# Altium schematic sheet Connectors.SchDoc
size A3; DocumentNumber: 2; SheetNumber: 2; SheetTotal: 9
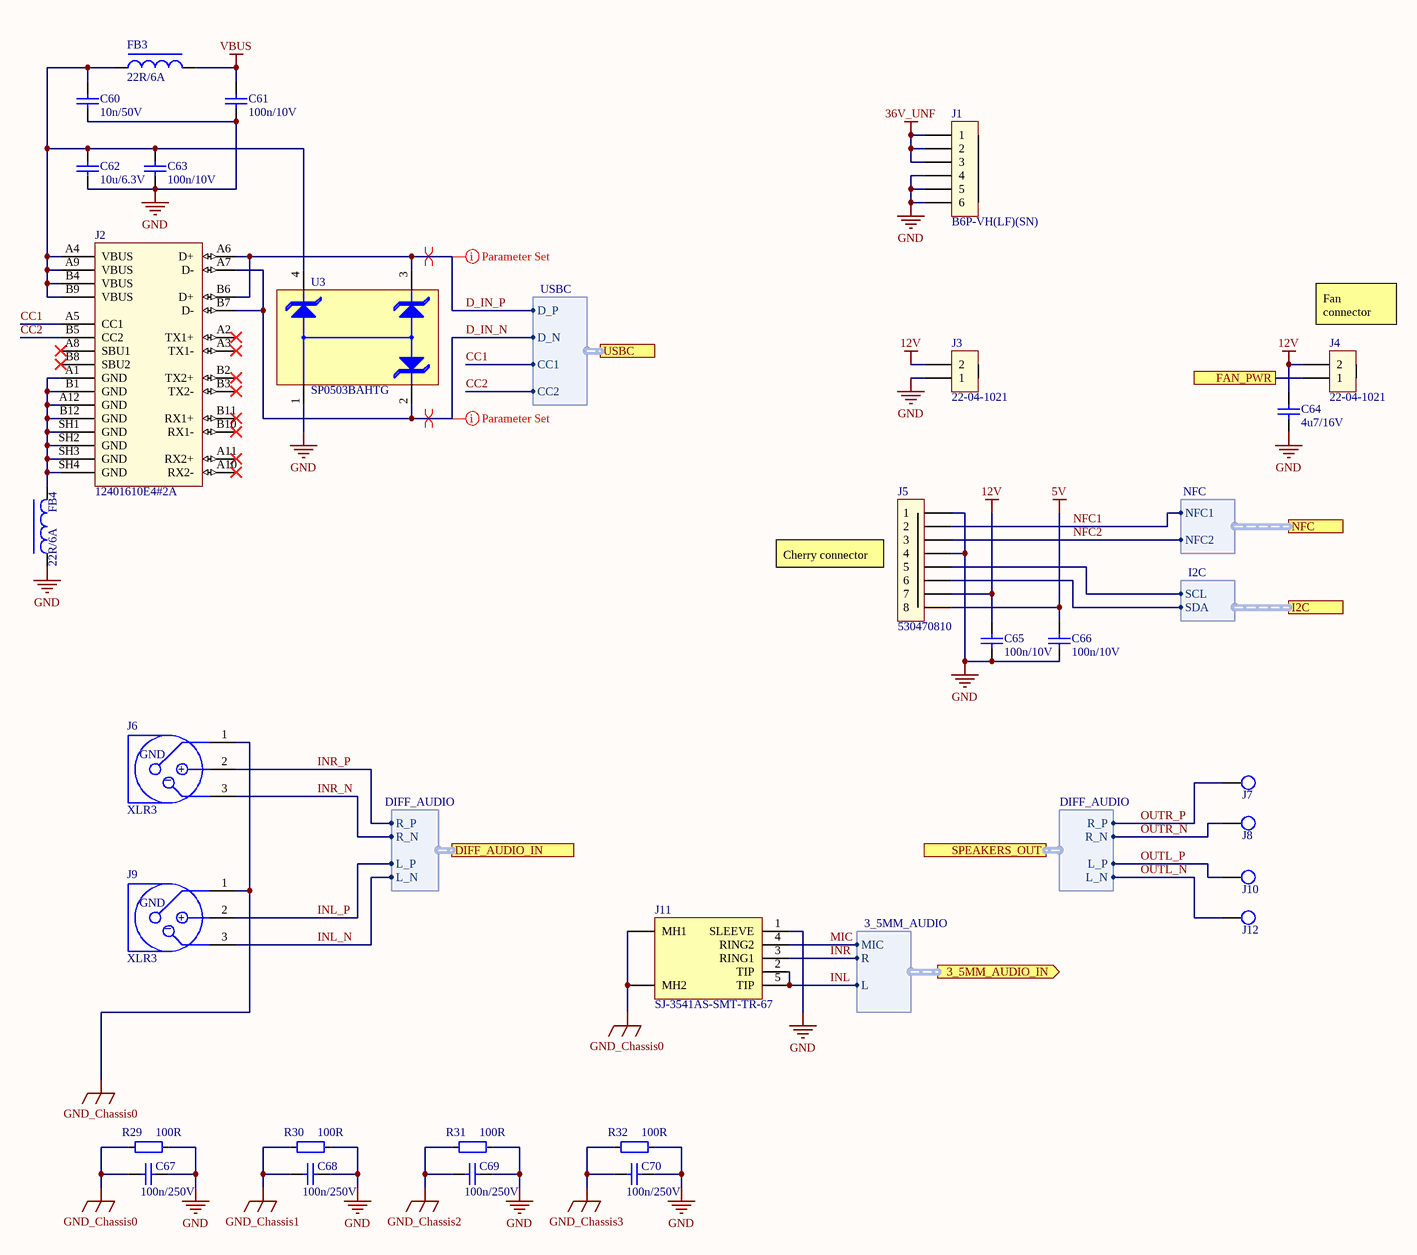
[diagram p0: Connectors.SchDoc]

## Parts
C60  10n/50V  [C0402]
C61  100n/10V  [C0402]
C62  10u/6.3V  [C0805]
C63  100n/10V  [C0402]
C64  4u7/16V  [C0805]
C65  100n/10V  [C0402]
C66  100n/10V  [C0402]
C67  100n/250V  [C1210]
C68  100n/250V  [C1210]
C69  100n/250V  [C1210]
C70  100n/250V  [C1210]
FB3  22R/6A  [FB0805]
FB4  22R/6A  [FB0805]
J1  B6P-VH(LF)(SN)  [B6P-VH]
J2  12401610E4#2A  [12401610E4#2A]
J3  22-04-1021  [22-04-1021]
J4  22-04-1021  [22-04-1021]
J5  530470810  [530470810]
J6  XLR3  [NC3FAAH1]
J7  AUDIO_JACK  [AUDIO_JACK_RED]  (value not drawn)
J8  AUDIO_JACK  [AUDIO_JACK_BLACK]  (value not drawn)
J9  XLR3  [NC3FAAH1]
J10  AUDIO_JACK  [AUDIO_JACK_RED]  (value not drawn)
J11  SJ-3541AS-SMT-TR-67  [SJ-3541AS-SMT-TR-67]
J12  AUDIO_JACK  [AUDIO_JACK_BLACK]  (value not drawn)
R29  100R  [R1206]
R30  100R  [R1206]
R31  100R  [R1206]
R32  100R  [R1206]
U3  SP0503BAHTG  [SOT143-4]

## Ports
3_5MM_AUDIO_IN (out, harness 3_5MM_AUDIO), DIFF_AUDIO_IN (harness DIFF_AUDIO), FAN_PWR, I2C (harness I2C), NFC (harness NFC), SPEAKERS_OUT (harness DIFF_AUDIO), USBC (harness USBC)

## Harnesses
USBC: D_P, D_N, CC1, CC2
DIFF_AUDIO: L_P, L_N, R_P, R_N
DIFF_AUDIO: L_N, L_P, R_N, R_P
3_5MM_AUDIO: R, L, MIC
NFC: NFC1, NFC2
I2C: SCL, SDA

## Nets
5V: C66.2 J5.8
12V: C64.2 C65.2 J3.2 J4.2 J5.7
36V_UNF: J1.1 J1.2 J1.3
GND: C60.1 C61.1 C62.1 C63.1 C64.1 C65.1 C66.1 C67.2 C68.2 C69.2 C70.2 FB4.1 J1.4 J1.5 J1.6 J3.1 J5.1 J5.4 J11.1(SLEEVE) R29.2 R30.2 R31.2 R32.2 U3.1
GND_Chassis0: C67.1 J6.1(GND) J9.1(GND) J11.MH1 J11.MH2 R29.1
GND_Chassis1: C68.1 R30.1
GND_Chassis2: C69.1 R31.1
GND_Chassis3: C70.1 R32.1
VBUS: C61.2 FB3.2
CC1: J2.A5(CC1) ; port USBC.CC1
CC2: J2.B5(CC2) ; port USBC.CC2
D_IN_N: J2.A7(D-) J2.B7(D-) U3.2 ; port USBC.D_N
D_IN_P: J2.A6(D+) J2.B6(D+) U3.3 ; port USBC.D_P
FAN_PWR: J4.1 ; port FAN_PWR
INL: J11.2(TIP) J11.5(TIP) ; port 3_5MM_AUDIO_IN.L
INL_N: J9.3(-) ; port DIFF_AUDIO_IN.L_N
INL_P: J9.2(+) ; port DIFF_AUDIO_IN.L_P
INR: J11.3(RING1) ; port 3_5MM_AUDIO_IN.R
INR_N: J6.3(-) ; port DIFF_AUDIO_IN.R_N
INR_P: J6.2(+) ; port DIFF_AUDIO_IN.R_P
MIC: J11.4(RING2) ; port 3_5MM_AUDIO_IN.MIC
NFC1: J5.2 ; port NFC.NFC1
NFC2: J5.3 ; port NFC.NFC2
OUTL_N: J12.1 ; port SPEAKERS_OUT.L_N
OUTL_P: J10.1 ; port SPEAKERS_OUT.L_P
OUTR_N: J8.1 ; port SPEAKERS_OUT.R_N
OUTR_P: J7.1 ; port SPEAKERS_OUT.R_P
NetC60_2: C60.2 C62.2 C63.2 FB3.1 J2.A4(VBUS) J2.A9(VBUS) J2.B4(VBUS) J2.B9(VBUS) U3.4
NetFB4_2: FB4.2 J2.A1(GND) J2.A12(GND) J2.B1(GND) J2.B12(GND) J2.SH1(GND) J2.SH2(GND) J2.SH3(GND) J2.SH4(GND)
NetJ5_5: J5.5 ; port I2C.SCL
NetJ5_6: J5.6 ; port I2C.SDA

Not connected (* = marked no-connect by the designer): J2 A2(TX1+)* A3(TX1-)* A8(SBU1)* A10(RX2-)* A11(RX2+)* B2(TX2+)* B3(TX2-)* B8(SBU2)* B10(RX1-)* B11(RX1+)*

## Layout directives
rule Impedance Constraint [Min = 80.00    Max = 100.0    ]: D_IN_N, D_IN_P
differential pair: D_IN_N, D_IN_P

## Notes on the sheet
- (near J4) Fan connector
- (near J5) Cherry connector
- Title
- Date:
- Number:
- Revision:
- Sheet
- of
- File:
- Author
- (in symbol NC3FAAH1) _

## Library data of the parts
C60 = 10n 50V X7R 0402: Manufacturer Part Number 1: 885012205067; Manufacturer 1: Wurth Elektronik; Voltage: 50V; Tolerance: 10%; Specifications: X7R 10n 50V ±10%; Capacitance: 10n; Dielectric: X7R; Supplier 1: Mouser; Supplier Part Number 1: 710-885012205067
C61 C63 C65 C66 = 100n 10V X5R 0402: Manufacturer Part Number 1: 885012105010; Manufacturer 1: Wurth Elektronik; Voltage: 10V; Tolerance: 20%; Specifications: X5R 100n 10V ±20%; Capacitance: 100n; Dielectric: X5R; Supplier 1: Mouser; Supplier Part Number 1: 710-885012105010
C62 = 10u 6V3 X7R 0805: Manufacturer Part Number 1: JMK212B7106KG-T; Manufacturer 1: Taiyo Yuden; Voltage: 6.3V; Tolerance: 10%; Specifications: X7R 10u 6.3V ±10%; Capacitance: 10u; Dielectric: X7R; Supplier 1: Mouser; Supplier Part Number 1: 963-JMK212B7106KG-T
C64 = 4u7 16V X7R 0805: Manufacturer Part Number 1: EMK212AB7475KGHT; Manufacturer 1: Taiyo Yuden; Voltage: 16V; Tolerance: 10%; Specifications: X7R 4u7 16V ±10%; Capacitance: 4u7; Dielectric: X7R; Supplier 1: Mouser; Supplier Part Number 1: 963-EMK212AB7475KGHT
C67-C70 = 100n 250V X7R 1206: Manufacturer Part Number 1: 885342208004; Manufacturer 1: Wurth Elektronik; Voltage: 250V; Tolerance: 10%; Specifications: X7R 100n 250V ±10%; Capacitance: 100n; Dielectric: X7R; Supplier 1: Mouser; Supplier Part Number 1: 710-885342208004
FB3 FB4 = BLM21PG220SN1D: 22 Ohms @ 100MHz 1 Power Line Ferrite Bead 0805 (2012 Metric) 6A 9mOhm; Specifications: 22R 6A 25%; Impedance: 22R; Resistance: 10mOhm; Tolerance: 25%; Manufacturer Part Number: BLM21PG220SN1D; Current: 6A; Supplier 1: Mouser; Supplier Part Number 1: 81-BLM21PG220SN1D; ComponentLink1Description: Datasheet; ComponentLink1URL: https://www.mouser.co.uk/datasheet/2/281/ENFA0005-1915781.pdf
J1 = B6P-VH(LF)(SN): Pin Header, Wire-to-Board, 3.96 mm, 1 Rows, 6 Contacts, Through Hole Straight, VH Series; Manufacturer 1: JST; ComponentLink1Description: Datasheet; ComponentLink1URL: http://www.farnell.com/datasheets/2578200.pdf; Manufacturer Part Number 1: B6P-VH(LF)(SN); Supplier 1: Farnell; Supplier Part Number 1: 2399166
J2 = 12401610E4#2A: USB Connectors USB TYPE C RCPT R/A SMT TOP MOUNT; Manufacturer 1: Amphenol; ComponentLink1Description: Datasheet; ComponentLink1URL: https://www.mouser.co.uk/datasheet/2/18/12401610e4x2a-1394819.pdf; Supplier 1: Mouser; Supplier Part Number 1: 523-12401610E4#2A; Manufacturer Part Number 1: 12401610E4#2A
J3 J4 = 22-04-1021: Pin Header, Wire-to-Board, 2.5 mm, 1 Rows, 2 Contacts, Through Hole Straight, KK 5045 Series; Manufacturer 1: Molex; Manufacturer Part Number 1: 22-04-1021; ComponentLink1Description: Datasheet; ComponentLink1URL: http://www.farnell.com/datasheets/1861359.pdf; Supplier 1: Farnell; Supplier Part Number 1: 9730940
J5 = 530470810: 1.25mm Pitch, PicoBlade PCB Header, Single Row, Vertical, Through Hole, Tin Plating, Friction Lock, 8 Circuits, Tray, 2.30mm PC Tail Length; Manufacturer 1: Molex; Manufacturer Part Number 1: 530470810; ComponentLink1Description: Datasheet; ComponentLink1URL: https://www.molex.com/webdocs/datasheets/pdf/en-us/0530470810_PCB_HEADERS.pdf; Supplier 1: Mouser; Supplier Part Number 1: 538-53047-0810
J6 J9 = NC3FAAH1: XLR Connectors 3P FEMALE HORIZ PIN 1 & GRD TOGETHER; Manufacturer 1: Neutrik; Supplier 1: Mouser; Supplier Part Number 1: 568-NC3FAAH-1; ComponentLink1Description: Datasheet; ComponentLink1URL: http://www.neutrik.us/en-us/xlr/aa-series/nc3faah1; Manufacturer Part Number 1: NC3FAAH1
J7 J8 J10 J12 = AUDIO_JACK: Speaker Spade Terminal Binding Post Metal Banana Plug Socket Connector; Supplier 1: Ebay; Supplier Part Number 1: https://www.ebay.co.uk/p/16004285643?iid=283347365473
J11 = SJ-3541AS-SMT-TR-67: 3.50mm (0.141", 1/8", Mini Plug) - Headphone Phone Jack 5 Conductor (TRRRS) Connector Solder; Manufacturer 1: CUI Devices; Supplier 1: Mouser; Supplier Part Number 1: 490-SJ-3541ASSMTTR67; ComponentLink1Description: Datasheet; ComponentLink1URL: https://www.cuidevices.com/product/resource/digikeypdf/sj-3541as-smt-tr-67.pdf; Manufacturer Part Number 1: SJ-3541AS-SMT-TR-67
R29-R32 = 100R 250mW 200V 1206: Manufacturer Part Number 1: CRCW1206100RFKEAC; Manufacturer 1: Vishay / Dale; Power Rating: 250mW; Tolerance: 1%; Voltage: 200V; Resistance: 100R; Specifications: =Resistance+ ' '+"Power Rating "+Voltage+' ±'+Tolerance; Supplier 1: Mouser; Supplier Part Number 1: 71-CRCW1206100RFKEAC
U3 = SP0503BAHTG: ESD Suppressors / TVS Diodes TVS AVAL DIODE SMT; Manufacturer 1: Littlefuse; Breakdown Voltage: 5.5V; Diode Capacitance: 30pF; Power Dissipation: 225mW; Specifications: 5.5V 30pF 225mW; ComponentLink1Description: Datasheet; ComponentLink1URL: https://www.mouser.co.uk/datasheet/2/240/Littelfuse_TVS_Diode_Array_SP05_Datasheet.pdf-777043.pdf; Stock: 8366; Supplier 1: Mouser; Supplier Part Number 1: 576-SP0503BAHTG; Manufacturer Part Number 1: SP0503BAHTG